# Altium project SAML21_Xplained_Pro.PrjPCB (part 3 of 3)
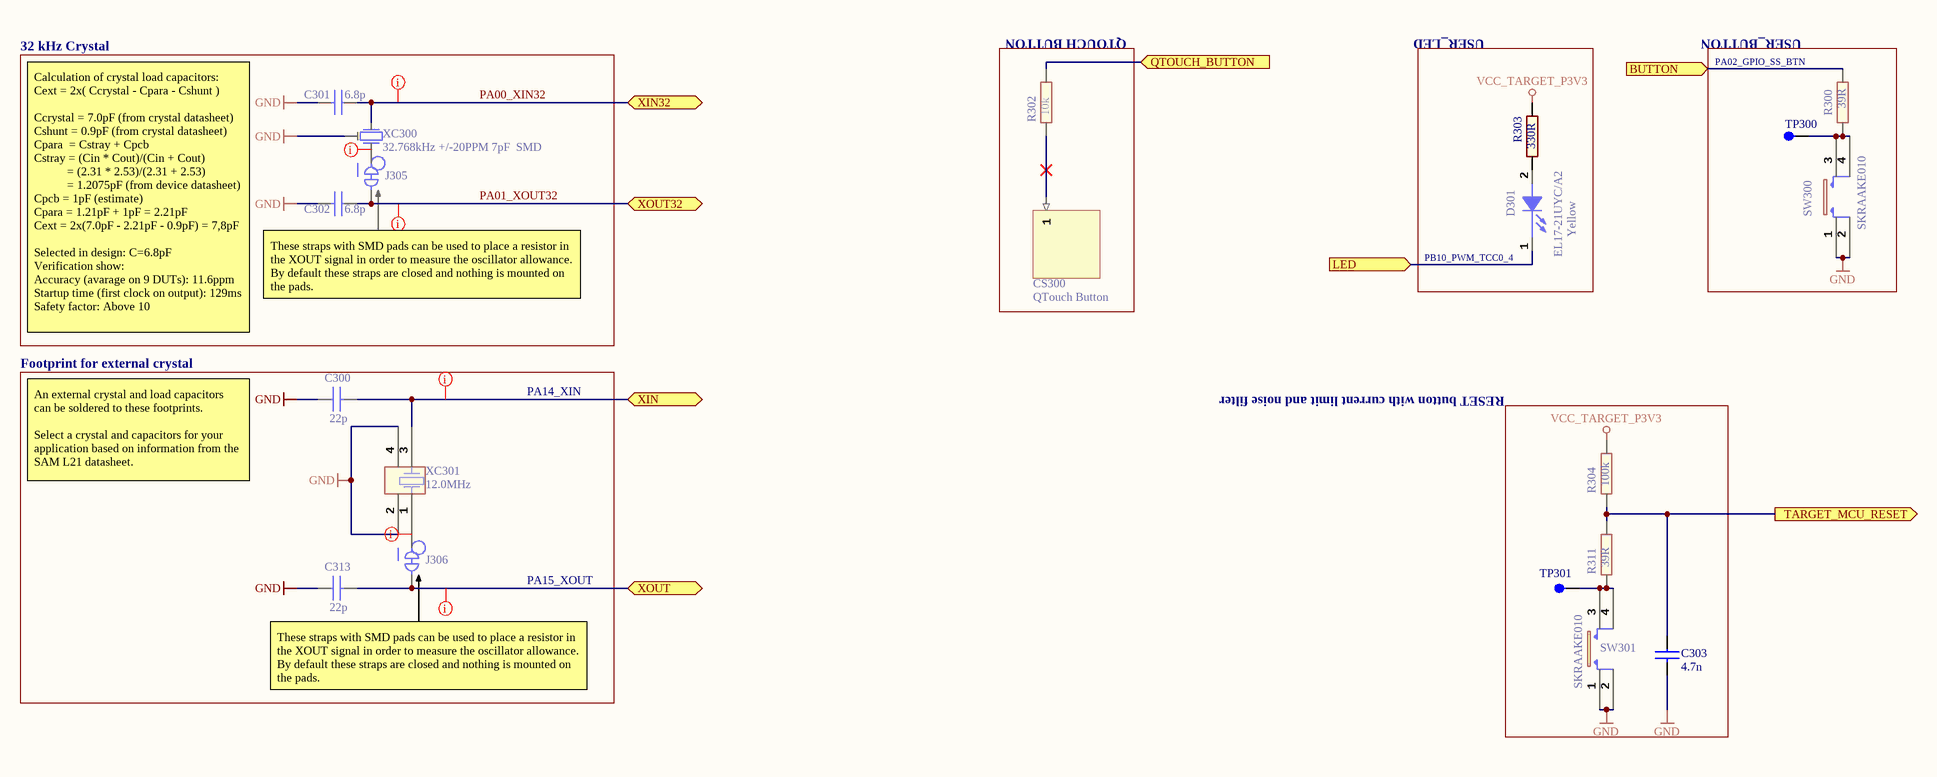
[diagram p10: SAML21_Xplained_Pro_SAML21_peripherals.SchDoc]

## Nets that join several sheets
GND: SAML21_Xplained_Pro_Target_MCU (15 pins), SAML21_Xplained_Pro_EDBG (33 pins), SAML21_Xplained_Pro_Connectors (15 pins), SAML21_Xplained_Pro_triple_input_power_supply (23 pins), SAML21_Xplained_Pro_current_measurement (Q501.2 R500.1), SAML21_Xplained_Pro_current_measurement_calibration (R803.1 R804.1 R805.1 R806.1), SAML21_Xplained_Pro_current_measurement_control (12 pins), SAML21_Xplained_Pro_current_measurement_frontend (13 pins), SAML21_Xplained_Pro_SAML21_peripherals (12 pins)
VCC_CM_P3V3: SAML21_Xplained_Pro_EDBG (23 pins), SAML21_Xplained_Pro_triple_input_power_supply (C100.1 U100.3), SAML21_Xplained_Pro_current_measurement (R501.2), SAML21_Xplained_Pro_current_measurement_calibration (R800.2 R801.2 R802.2), SAML21_Xplained_Pro_current_measurement_control (6 pins), SAML21_Xplained_Pro_current_measurement_frontend (L700.1)
VCC_EDBG_USB_P5V0: SAML21_Xplained_Pro_EDBG (C408.1 L401.2 U400.A10), SAML21_Xplained_Pro_triple_input_power_supply (C102.1 R103.2 U101.3 U101.8)
VCC_EXT_P5V0: SAML21_Xplained_Pro_Connectors (J202.1), SAML21_Xplained_Pro_triple_input_power_supply (Q100.3)
VCC_MCU_P3V3: SAML21_Xplained_Pro_Target_MCU (6 pins), SAML21_Xplained_Pro_triple_input_power_supply (J103.1)
VCC_P5V0: SAML21_Xplained_Pro_Connectors (J202.3), SAML21_Xplained_Pro_triple_input_power_supply (12 pins), SAML21_Xplained_Pro_current_measurement_control (R604.2), SAML21_Xplained_Pro_current_measurement_frontend (L701.1)
VCC_TARGET_P3V3: SAML21_Xplained_Pro_Target_MCU (R306.2 R310.2), SAML21_Xplained_Pro_Connectors (5 pins), SAML21_Xplained_Pro_triple_input_power_supply (J101.2 R107.1 R108.2), SAML21_Xplained_Pro_SAML21_peripherals (R303.2 R304.2)
VCC_TARGET_USB_P5V0: SAML21_Xplained_Pro_Connectors (D200.4 J204.1 R200.2), SAML21_Xplained_Pro_triple_input_power_supply (C103.1 R104.2 U101.6 U102.1)
CM_PA00_GPIO: SAML21_Xplained_Pro_current_measurement_calibration (Q801.1 R801.1), SAML21_Xplained_Pro_current_measurement_control (U600.1)
CM_PA01_GPIO: SAML21_Xplained_Pro_current_measurement_calibration (Q800.1 R802.1), SAML21_Xplained_Pro_current_measurement_control (U600.2)
CM_PA05_AIN5: SAML21_Xplained_Pro_current_measurement_control (U600.5 U600.6), SAML21_Xplained_Pro_current_measurement_frontend (C706.2 R708.2 U700.7)
CM_PA08_AIN16: SAML21_Xplained_Pro_current_measurement_control (U600.11), SAML21_Xplained_Pro_current_measurement_frontend (C702.2 R703.2 U700.1)
CM_PA09_AIN17: SAML21_Xplained_Pro_EDBG (U400.K10), SAML21_Xplained_Pro_triple_input_power_supply (R109.1 R110.2), SAML21_Xplained_Pro_current_measurement_control (U600.12)
CM_PA10_GPIO: SAML21_Xplained_Pro_current_measurement (Q500.1 Q501.1 R500.2), SAML21_Xplained_Pro_current_measurement_control (U600.13)
CM_PA11_GCLK5: SAML21_Xplained_Pro_EDBG (U400.J3), SAML21_Xplained_Pro_current_measurement_control (U600.14)
CM_PA14_GCLK0: SAML21_Xplained_Pro_EDBG (U400.C1), SAML21_Xplained_Pro_current_measurement_control (U600.15)
CM_PA15_GPIO: SAML21_Xplained_Pro_current_measurement_calibration (Q802.1 R800.1), SAML21_Xplained_Pro_current_measurement_control (U600.16)
CM_PA16_SERCOM1_SDA: SAML21_Xplained_Pro_EDBG (U400.J7), SAML21_Xplained_Pro_current_measurement_control (R603.1 U600.17)
CM_PA17_SERCOM1_SCL: SAML21_Xplained_Pro_EDBG (U400.K7), SAML21_Xplained_Pro_current_measurement_control (R602.1 U600.18)
CM_PA18_CMP0: SAML21_Xplained_Pro_current_measurement_control (U600.19), SAML21_Xplained_Pro_current_measurement_frontend (Q700.1 R701.2)
CM_PA22_SERCOM3_PAD0_SPI_MOSI: SAML21_Xplained_Pro_EDBG (U400.C2), SAML21_Xplained_Pro_current_measurement_control (U600.21)
CM_PA23_SERCOM3_PAD1_SPI_SCK: SAML21_Xplained_Pro_EDBG (U400.C4), SAML21_Xplained_Pro_current_measurement_control (U600.22)
CM_PA24_SERCOM3_PAD2_SPI_MISO: SAML21_Xplained_Pro_EDBG (U400.B1), SAML21_Xplained_Pro_current_measurement_control (U600.23)
CM_PA25_SPI_SS: SAML21_Xplained_Pro_EDBG (U400.D1), SAML21_Xplained_Pro_current_measurement_control (U600.24)
CM_PA30_SWCLK: SAML21_Xplained_Pro_EDBG (U400.F4), SAML21_Xplained_Pro_current_measurement_control (U600.31)
CM_PA31_SWDIO: SAML21_Xplained_Pro_EDBG (U400.E3), SAML21_Xplained_Pro_current_measurement_control (U600.32)
CM_RESET_N: SAML21_Xplained_Pro_EDBG (U400.F3), SAML21_Xplained_Pro_current_measurement_control (U600.26)
EDBG_CDC_USART_RX: SAML21_Xplained_Pro_Target_MCU (U300.43), SAML21_Xplained_Pro_EDBG (U400.F9)
EDBG_DGI_SCL: SAML21_Xplained_Pro_Target_MCU (R306.1 U300.18), SAML21_Xplained_Pro_EDBG (U400.F7), SAML21_Xplained_Pro_Connectors (J200.12 J201.12 J203.12)
EDBG_DGI_SDA: SAML21_Xplained_Pro_Target_MCU (R310.1 U300.17), SAML21_Xplained_Pro_EDBG (U400.G7), SAML21_Xplained_Pro_Connectors (J200.11 J201.11 J203.11)
EDBG_SPI_DGI_MOSI: SAML21_Xplained_Pro_Target_MCU (U300.49), SAML21_Xplained_Pro_EDBG (U400.K3), SAML21_Xplained_Pro_Connectors (J201.16 J203.16)
EDBG_SPI_DGI_SCK: SAML21_Xplained_Pro_Target_MCU (U300.50), SAML21_Xplained_Pro_EDBG (U400.J4), SAML21_Xplained_Pro_Connectors (J201.18 J203.18)
EDBG_SPI_DGI_SS: SAML21_Xplained_Pro_Target_MCU (U300.60), SAML21_Xplained_Pro_EDBG (U400.G5)
ID1: SAML21_Xplained_Pro_EDBG (R409.1 U400.A1), SAML21_Xplained_Pro_Connectors (J200.1)
ID2: SAML21_Xplained_Pro_EDBG (R402.1 U400.B2), SAML21_Xplained_Pro_Connectors (J201.1)
ID3: SAML21_Xplained_Pro_EDBG (R401.1 U400.B3), SAML21_Xplained_Pro_Connectors (J203.1)
NetJ101_3: SAML21_Xplained_Pro_triple_input_power_supply (J101.3 J102.3), SAML21_Xplained_Pro_current_measurement (Q500.3)
NetQ500_2: SAML21_Xplained_Pro_current_measurement (Q500.2 Q502.2), SAML21_Xplained_Pro_current_measurement_frontend (Q700.3 R702.2 U701.2)
NetQ502_3: SAML21_Xplained_Pro_current_measurement (Q502.3), SAML21_Xplained_Pro_current_measurement_calibration (Q800.2 Q801.2 Q802.2 R806.2)
PA00_XIN32: SAML21_Xplained_Pro_Target_MCU (U300.1), SAML21_Xplained_Pro_SAML21_peripherals (C301.1 XC300.2)
PA01_XOUT32: SAML21_Xplained_Pro_Target_MCU (U300.2), SAML21_Xplained_Pro_SAML21_peripherals (C302.1 J305.2)
PA02_GPIO_SS_BTN: SAML21_Xplained_Pro_Target_MCU (U300.3), SAML21_Xplained_Pro_Connectors (J200.10), SAML21_Xplained_Pro_SAML21_peripherals (R300.2)
PA03_ADC1: SAML21_Xplained_Pro_Target_MCU (U300.4), SAML21_Xplained_Pro_Connectors (J200.4)
PA04_S0_SPI_MISO: SAML21_Xplained_Pro_Target_MCU (U300.13), SAML21_Xplained_Pro_Connectors (J200.17)
PA05_S0_SPI_SS: SAML21_Xplained_Pro_Target_MCU (U300.14), SAML21_Xplained_Pro_Connectors (J200.15)
PA06_S0_SPI_MOSI: SAML21_Xplained_Pro_Target_MCU (U300.15), SAML21_Xplained_Pro_Connectors (J200.16)
PA07_S0_SPI_SCK: SAML21_Xplained_Pro_Target_MCU (U300.16), SAML21_Xplained_Pro_Connectors (J200.18)
PA10_ADC18_PTCY8: SAML21_Xplained_Pro_Target_MCU (U300.19), SAML21_Xplained_Pro_Connectors (J201.3), SAML21_Xplained_Pro_SAML21_peripherals (R302.2)
PA11_ADC19: SAML21_Xplained_Pro_Target_MCU (U300.20), SAML21_Xplained_Pro_Connectors (J201.4)
PA12_PWM_TCC2_0: SAML21_Xplained_Pro_Target_MCU (U300.29), SAML21_Xplained_Pro_Connectors (J200.7)
PA13_PWM_TCC2_1: SAML21_Xplained_Pro_Target_MCU (U300.30), SAML21_Xplained_Pro_Connectors (J200.8)
PA14: SAML21_Xplained_Pro_Target_MCU (J302.1 U300.31), SAML21_Xplained_Pro_SAML21_peripherals (C300.2 XC301.3)
PA14_USB_VBUS: SAML21_Xplained_Pro_Target_MCU (J302.2), SAML21_Xplained_Pro_Connectors (R200.1 R201.2)
PA15: SAML21_Xplained_Pro_Target_MCU (J300.1 U300.32), SAML21_Xplained_Pro_SAML21_peripherals (C313.2 J306.2)
PA15_GPIO: SAML21_Xplained_Pro_Target_MCU (J300.2), SAML21_Xplained_Pro_Connectors (J203.6)
PA16_GPIO_IRQ: SAML21_Xplained_Pro_Target_MCU (U300.35), SAML21_Xplained_Pro_EDBG (R417.1), SAML21_Xplained_Pro_Connectors (J203.9), SAML21_Xplained_Pro_current_measurement_control (R600.2)
PA17_GPIO: SAML21_Xplained_Pro_Target_MCU (U300.36), SAML21_Xplained_Pro_Connectors (J201.15)
PA18_S1_UART_TX: SAML21_Xplained_Pro_Target_MCU (U300.37), SAML21_Xplained_Pro_Connectors (J201.14 J203.14)
PA19_S1_UART_RX: SAML21_Xplained_Pro_Target_MCU (U300.38), SAML21_Xplained_Pro_Connectors (J201.13 J203.13)
PA20_GPIO: SAML21_Xplained_Pro_Target_MCU (U300.41), SAML21_Xplained_Pro_EDBG (R418.1), SAML21_Xplained_Pro_Connectors (J201.5)
PA21_GPIO: SAML21_Xplained_Pro_Target_MCU (U300.42), SAML21_Xplained_Pro_EDBG (R419.1), SAML21_Xplained_Pro_Connectors (J201.6)
PA23_S3_UART_RX: SAML21_Xplained_Pro_Target_MCU (U300.44), SAML21_Xplained_Pro_EDBG (R414.1)
PA27_GPIO_SS: SAML21_Xplained_Pro_Target_MCU (U300.51), SAML21_Xplained_Pro_Connectors (J203.10)
PB00_ADC8: SAML21_Xplained_Pro_Target_MCU (U300.61), SAML21_Xplained_Pro_Connectors (J203.3)
PB01_ADC9: SAML21_Xplained_Pro_Target_MCU (U300.62), SAML21_Xplained_Pro_EDBG (R416.1), SAML21_Xplained_Pro_Connectors (J203.4), SAML21_Xplained_Pro_current_measurement_control (R601.2)
PB02_USB_ID: SAML21_Xplained_Pro_Target_MCU (U300.63), SAML21_Xplained_Pro_Connectors (R203.2)
PB04_GPIO_IRQ4: SAML21_Xplained_Pro_Target_MCU (U300.5), SAML21_Xplained_Pro_Connectors (J200.9)
PB05_ADC13: SAML21_Xplained_Pro_Target_MCU (U300.6), SAML21_Xplained_Pro_Connectors (J200.3)
PB06_GPIO: SAML21_Xplained_Pro_Target_MCU (U300.9), SAML21_Xplained_Pro_Connectors (J200.5)
PB07_GPIO: SAML21_Xplained_Pro_Target_MCU (U300.10), SAML21_Xplained_Pro_Connectors (J200.6)
PB08_S4_UART_TX: SAML21_Xplained_Pro_Target_MCU (U300.11), SAML21_Xplained_Pro_Connectors (J200.14)
PB09_S4_UART_RX: SAML21_Xplained_Pro_Target_MCU (U300.12), SAML21_Xplained_Pro_Connectors (J200.13)
PB10_PWM_TCC0_4: SAML21_Xplained_Pro_Target_MCU (U300.23), SAML21_Xplained_Pro_Connectors (J203.7), SAML21_Xplained_Pro_SAML21_peripherals (D301.1)
PB11_PWM_TCC0_5: SAML21_Xplained_Pro_Target_MCU (U300.24), SAML21_Xplained_Pro_Connectors (J203.8)
PB12_PWM_TC4_0: SAML21_Xplained_Pro_Target_MCU (U300.25), SAML21_Xplained_Pro_Connectors (J201.7)
PB13_PWM_TC4_1: SAML21_Xplained_Pro_Target_MCU (U300.26), SAML21_Xplained_Pro_Connectors (J201.8)
PB14_GPIO_IRQ14: SAML21_Xplained_Pro_Target_MCU (U300.27), SAML21_Xplained_Pro_Connectors (J201.9)
PB15_GPIO_SS: SAML21_Xplained_Pro_Target_MCU (U300.28), SAML21_Xplained_Pro_Connectors (J201.10)
PB16_S5_SPI_MISO: SAML21_Xplained_Pro_Target_MCU (U300.39), SAML21_Xplained_Pro_EDBG (R420.2), SAML21_Xplained_Pro_Connectors (J201.17 J203.17)
PB17_S5_SPI_SS: SAML21_Xplained_Pro_Target_MCU (U300.40), SAML21_Xplained_Pro_Connectors (J203.15)
PB30_GPIO: SAML21_Xplained_Pro_Target_MCU (U300.59), SAML21_Xplained_Pro_Connectors (J203.5)
SWDCLK: SAML21_Xplained_Pro_Target_MCU (R301.2), SAML21_Xplained_Pro_EDBG (U400.D6), SAML21_Xplained_Pro_Connectors (J205.4)
SWDIO: SAML21_Xplained_Pro_Target_MCU (R307.2), SAML21_Xplained_Pro_EDBG (U400.C5), SAML21_Xplained_Pro_Connectors (J205.2)
TARGET_MCU_RESET: SAML21_Xplained_Pro_Target_MCU (R305.2 U300.52), SAML21_Xplained_Pro_EDBG (U400.H2), SAML21_Xplained_Pro_SAML21_peripherals (C303.1 R304.1 R311.2)
TARGET_RESET: SAML21_Xplained_Pro_Target_MCU (R305.1), SAML21_Xplained_Pro_EDBG (U400.B4), SAML21_Xplained_Pro_Connectors (J205.10)
TARGET_USB_ID: SAML21_Xplained_Pro_Connectors (J204.4 R203.1), SAML21_Xplained_Pro_triple_input_power_supply (R108.1 U102.4)
TARGET_USB_N: SAML21_Xplained_Pro_Target_MCU (U300.45), SAML21_Xplained_Pro_Connectors (D200.3 J204.2)
TARGET_USB_P: SAML21_Xplained_Pro_Target_MCU (U300.46), SAML21_Xplained_Pro_Connectors (D200.2 J204.3)
VCC_P3V3_CM_IN: SAML21_Xplained_Pro_triple_input_power_supply (J100.1 J101.1 J102.1 R109.2), SAML21_Xplained_Pro_current_measurement_frontend (R700.1 R701.1 R702.1 R704.2)

## Assembly variants
Default_assembly: not fitted C200 C300 C313 C403 C705 R202 R424 XC301